# EAGLE schematic TinyMicroGameboy-smallbuttons (EAGLE 6.5.0)
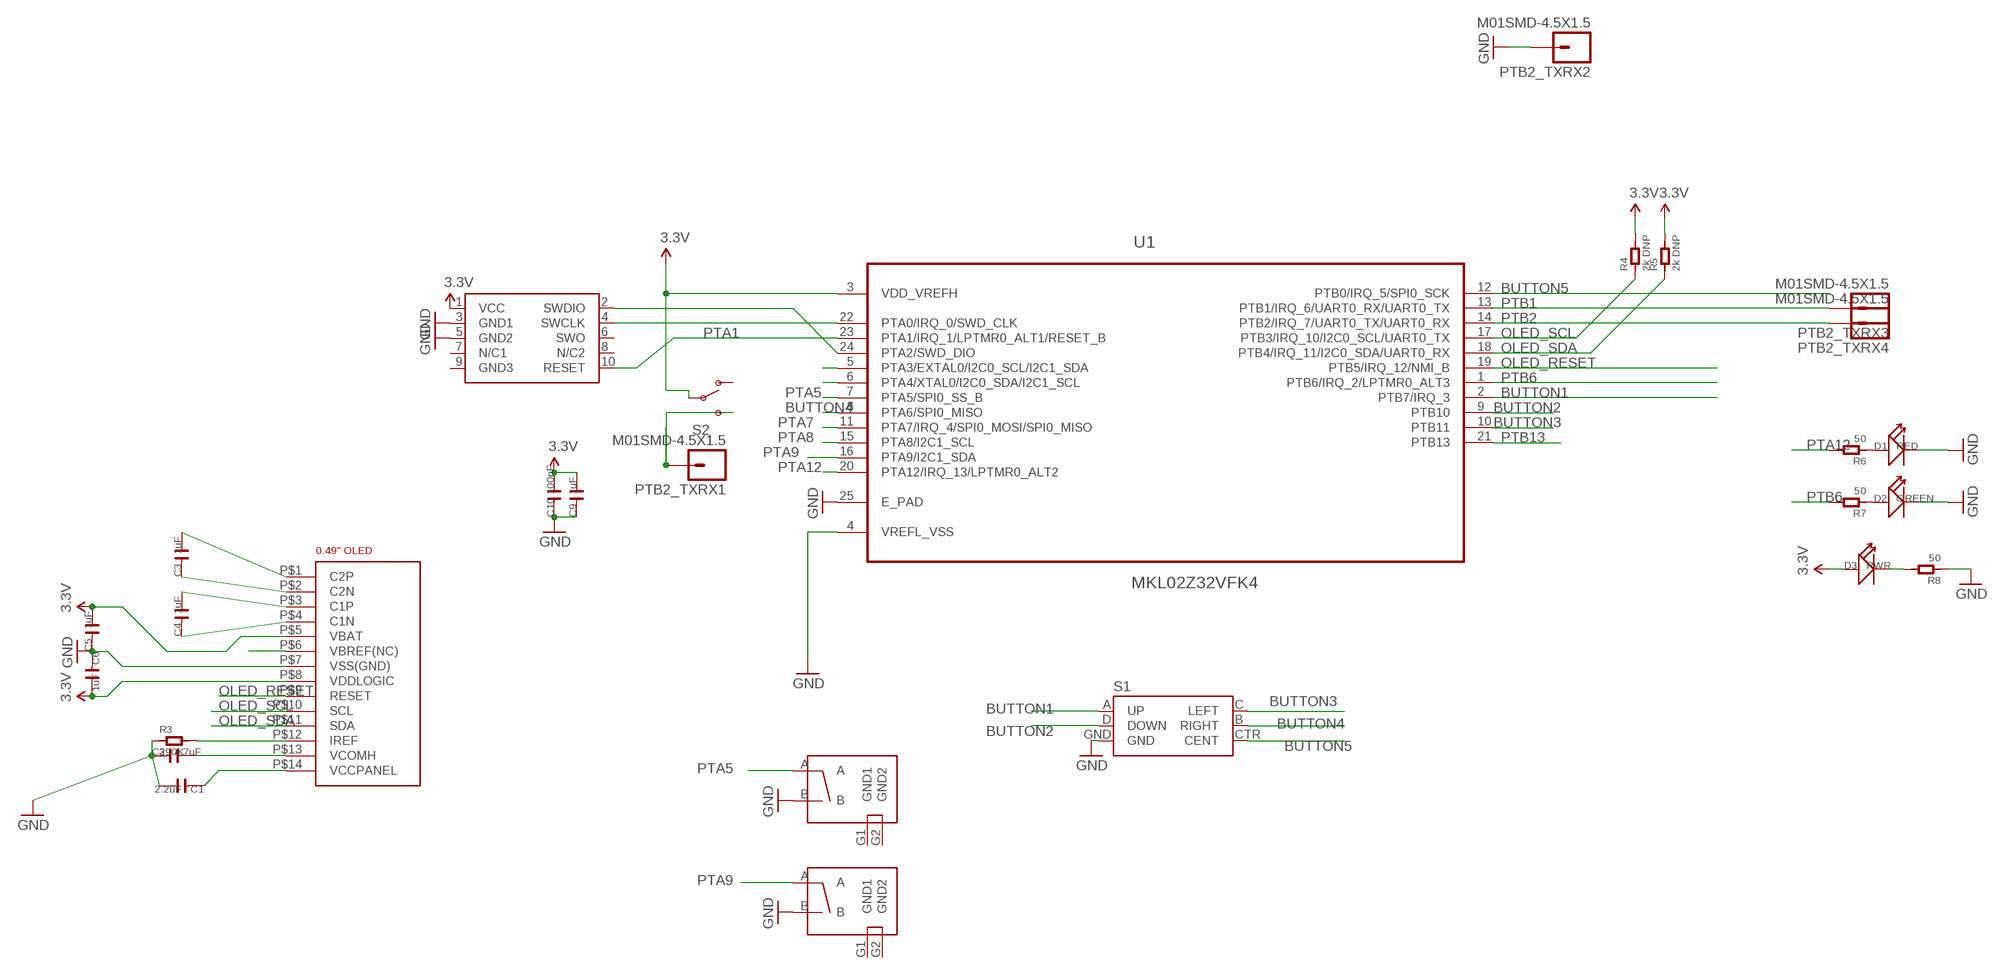
[diagram p0: schematic, sheet 1]

## Parts
C1  2.2uF  C-0603  [C0603]
C2  4.7uF  C-0603  [C0603]
C3  1uF  C-0603  [C0603]
C4  1uF  C-0603  [C0603]
C5  1uF  C-0603  [C0603]
C6  1uF  C-0603  [C0603]
C9  1uF  C-0603  [C0603]
C10  100nF  C-0603  [C0603]
D1  RED  LED  [LED0603]
D2  GREEN  LED  [LED0603]
D3  PWR  LED  [LED0603]
PTB2_TXRX1  M01SMD-4.5X1.5  [PAD-1.5X4.5]
PTB2_TXRX2  M01SMD-4.5X1.5  [PAD-1.5X4.5]
PTB2_TXRX3  M01SMD-4.5X1.5  [PAD-1.5X4.5]
PTB2_TXRX4  M01SMD-4.5X1.5  [PAD-1.5X4.5]
R3  390K  R-0603  [R0603]
R4  2k DNP  R-0603  [R0603]
R5  2k DNP  R-0603  [R0603]
R6  50  R-0603  [R0603]
R7  50  R-0603  [R0603]
R8  50  R-0603  [R0603]
S1  JOYSTICK_MINI  [JOYSTICK_MINI]
S2  SWITCH-SPDT-SMD-A  [SWITCH-SPST-SMD-A]
SWD1  CORTEX_SWD  [M50-3600542]
U1  MKL02Z32VFK4  [QFN50P400X400X100-25N]
U$1  0.49"OLEDFOLDED  [0.49"-FPC-0.7-14-FOLDED]
U$2  2PSWITCH_SMT_SIDEMOUNT  [2X4TACT]
U$3  2PSWITCH_SMT_SIDEMOUNT  [2X4TACT]

## Nets
3.3V: C5.2 C6.2 C9.2 C10.2 D3.+ R4.2 R5.2 S2.2(P) SWD1.1(VCC) U1.3(VDD_VREFH) U$1.P$5(VBAT) U$1.P$8(VDDLOGIC)
BUTTON1: S1.A(UP) U1.2(PTB7/IRQ_3)
BUTTON2: S1.D(DOWN) U1.9(PTB10)
BUTTON3: S1.C(LEFT) U1.10(PTB11)
BUTTON4: S1.B(RIGHT) U1.8(PTA6/SPI0_MISO)
BUTTON5: S1.CTR(CENT) U1.12(PTB0/IRQ_5/SPI0_SCK)
C1N: C4.1 U$1.P$4(C1N)
C1P: C4.2 U$1.P$3(C1P)
C2N: C3.1 U$1.P$2(C2N)
C2P: C3.2 U$1.P$1(C2P)
GND: C1.2 C2.1 C5.1 C6.1 C9.1 C10.1 D1.- D2.- PTB2_TXRX2.P$1 R3.1 R8.1 S1.GND SWD1.3(GND1) SWD1.5(GND2) U1.4(VREFL_VSS) U1.25(E_PAD) U$1.P$7(VSS(GND)) U$2.B U$3.B
IREF: R3.2 U$1.P$12(IREF)
N$1: U1.5(PTA3/EXTAL0/I2C0_SCL/I2C1_SDA)
N$2: U1.6(PTA4/XTAL0/I2C0_SDA/I2C1_SCL)
N$5: SWD1.4(SWCLK) U1.22(PTA0/IRQ_0/SWD_CLK)
N$6: D1.+ R6.1
N$7: SWD1.2(SWDIO) U1.24(PTA2/SWD_DIO)
N$8: U$1.P$6(VBREF(NC))
N$14: D2.+ R7.1
N$19: D3.- R8.2
N$20: PTB2_TXRX1.P$1 S2.3(S)
OLED_RESET: U1.19(PTB5/IRQ_12/NMI_B) U$1.P$9(RESET)
OLED_SCL: R4.1 U1.17(PTB3/IRQ_10/I2C0_SCL/UART0_TX) U$1.P$10(SCL)
OLED_SDA: R5.1 U1.18(PTB4/IRQ_11/I2C0_SDA/UART0_RX) U$1.P$11(SDA)
PTA1: SWD1.10(RESET) U1.23(PTA1/IRQ_1/LPTMR0_ALT1/RESET_B)
PTA5: U1.7(PTA5/SPI0_SS_B) U$2.A
PTA7: U1.11(PTA7/IRQ_4/SPI0_MOSI/SPI0_MISO)
PTA8: U1.15(PTA8/I2C1_SCL)
PTA9: U1.16(PTA9/I2C1_SDA) U$3.A
PTA12: R6.2 U1.20(PTA12/IRQ_13/LPTMR0_ALT2)
PTB1: PTB2_TXRX3.P$1 U1.13(PTB1/IRQ_6/UART0_RX/UART0_TX)
PTB2: PTB2_TXRX4.P$1 U1.14(PTB2/IRQ_7/UART0_TX/UART0_RX)
PTB6: R7.2 U1.1(PTB6/IRQ_2/LPTMR0_ALT3)
PTB13: U1.21(PTB13)
VCCPANEL: C1.1 U$1.P$14(VCCPANEL)
VCOMH: C2.2 U$1.P$13(VCOMH)
Unconnected: S2.1(O) SWD1.6(SWO) SWD1.7(N/C1) SWD1.8(N/C2) SWD1.9(GND3) U$2.G1(GND1) U$2.G2(GND2) U$3.G1(GND1) U$3.G2(GND2)

## Library data of the parts
C1-C6 C9 C10 = OPL:C*
D1-D3 = OPL:LED*: LED
PTB2_TXRX1-PTB2_TXRX4 = SparkFun-Connectors:M01: Header 1 Standard 1-pin 0.1" header. Use with straight break away headers (SKU : PRT-00116), right angle break away headers (PRT-00553), swiss pins (PRT-00743), machine pins (PRT-00117), and female headers (PRT-00115).
R3-R8 = OPL:R*
S1 = SparkFun-Electromechanical:JOYSTICK_MINI: Small 5-way tactile joystick, COM-10063 4UCON SF303GJ26
S2 = SparkFun-Electromechanical:SWITCH-SPDT: SPDT Switch Simple slide switch, Spark Fun Electronics SKU : COM-00102 DPDT SMT slide switch, AYZ0202, SWCH-08179
SWD1 = carrilib with jtags:CORTEX_SWD: .05" Cortex M Connector in SWD mode Manufacturer: Generic Part Number: Cortex M SWD Notes: I use Harwin M50-3600542 connectors
U1 = FarnellThings:MKL02Z32VFK4: IC, MCU, 32BIT, CORTEX M0+, 48MHZ, QFN-24; MPN: MKL02Z32VFK4; OC_FARNELL: 2321481; OC_NEWARK: 61W9887; PACKAGE: QFN-24; SUPPLIER: FREESCALE SEMICONDUCTOR
U$1 = zephod-tft:0.49"OLED
U$2 U$3 = zephod-components:2PSWITCH_SMT_SIDEMOUNT